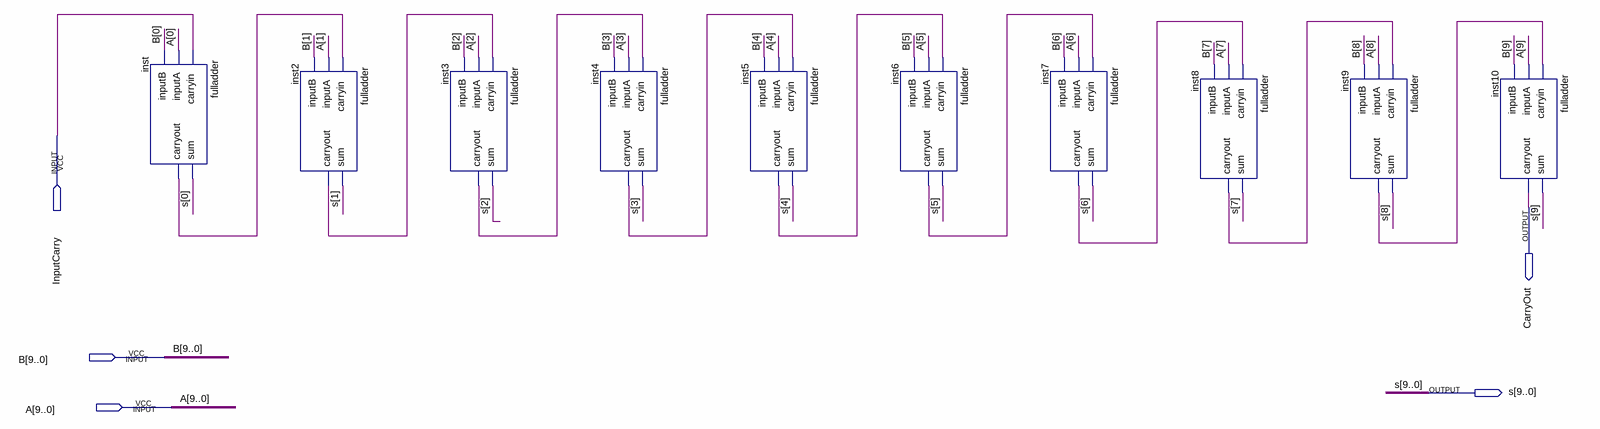
[diagram p0: schematic sheet]
// Quartus schematic tenbitfulladder.bdf as structural Verilog: 10 symbols, 5 pins
module tenbitfulladder (
  input  InputCarry,
  input  [9:0] B,
  input  [9:0] A,
  output CarryOut,
  output [9:0] s
);

  wire inst2_carryout, inst3_carryout, inst4_carryout, inst5_carryout, inst6_carryout, inst7_carryout,
       inst8_carryout, inst9_carryout, inst_carryout;

  fulladder inst (.carryin(InputCarry), .inputA(A[0]), .inputB(B[0]), .sum(s[0]), .carryout(inst_carryout));
  fulladder inst2 (.carryin(inst_carryout), .inputA(A[1]), .inputB(B[1]), .sum(s[1]), .carryout(inst2_carryout));
  fulladder inst3 (.carryin(inst2_carryout), .inputA(A[2]), .inputB(B[2]), .sum(s[2]), .carryout(inst3_carryout));
  fulladder inst4 (.carryin(inst3_carryout), .inputA(A[3]), .inputB(B[3]), .sum(s[3]), .carryout(inst4_carryout));
  fulladder inst5 (.carryin(inst4_carryout), .inputA(A[4]), .inputB(B[4]), .sum(s[4]), .carryout(inst5_carryout));
  fulladder inst6 (.carryin(inst5_carryout), .inputA(A[5]), .inputB(B[5]), .sum(s[5]), .carryout(inst6_carryout));
  fulladder inst7 (.carryin(inst6_carryout), .inputA(A[6]), .inputB(B[6]), .sum(s[6]), .carryout(inst7_carryout));
  fulladder inst8 (.carryin(inst7_carryout), .inputA(A[7]), .inputB(B[7]), .sum(s[7]), .carryout(inst8_carryout));
  fulladder inst9 (.carryin(inst8_carryout), .inputA(A[8]), .inputB(B[8]), .sum(s[8]), .carryout(inst9_carryout));
  fulladder inst10 (.carryin(inst9_carryout), .inputA(A[9]), .inputB(B[9]), .sum(s[9]), .carryout(CarryOut));
endmodule
